# Altium schematic sheet SAMC21N_Xplained_Pro_Level_Converters.SchDoc: Data Level Converters
size A3; Organization: Microchip India; DocumentNumber: A09-2682; Revision: 4; SheetNumber: 7; SheetTotal: 9; CheckedBy: M.S.K; DrawnBy: Microchip India; PageSetup: Record=PageOptions|CenterHorizontal=True|CenterVertical=True|PrintScale=0.71|XCorrection=1.00|YCorrection=1.00|PrintKind=0|BorderSize=5000000|LeftOffset=0|BottomOffset=0|Orientation=2|PaperLength=1000|PaperWidth=1000|Scale=100|PaperSource=15|PrintQuality=600|MediaType=1|DitherType=10|PrintScaleMode=1|PaperKind=A4 (210 x 297 mm)|PaperIndex=9; ProjectTitle: ATSAMC21N-XPRO; PCBNumber: A08-2581; PCBRevision: 2
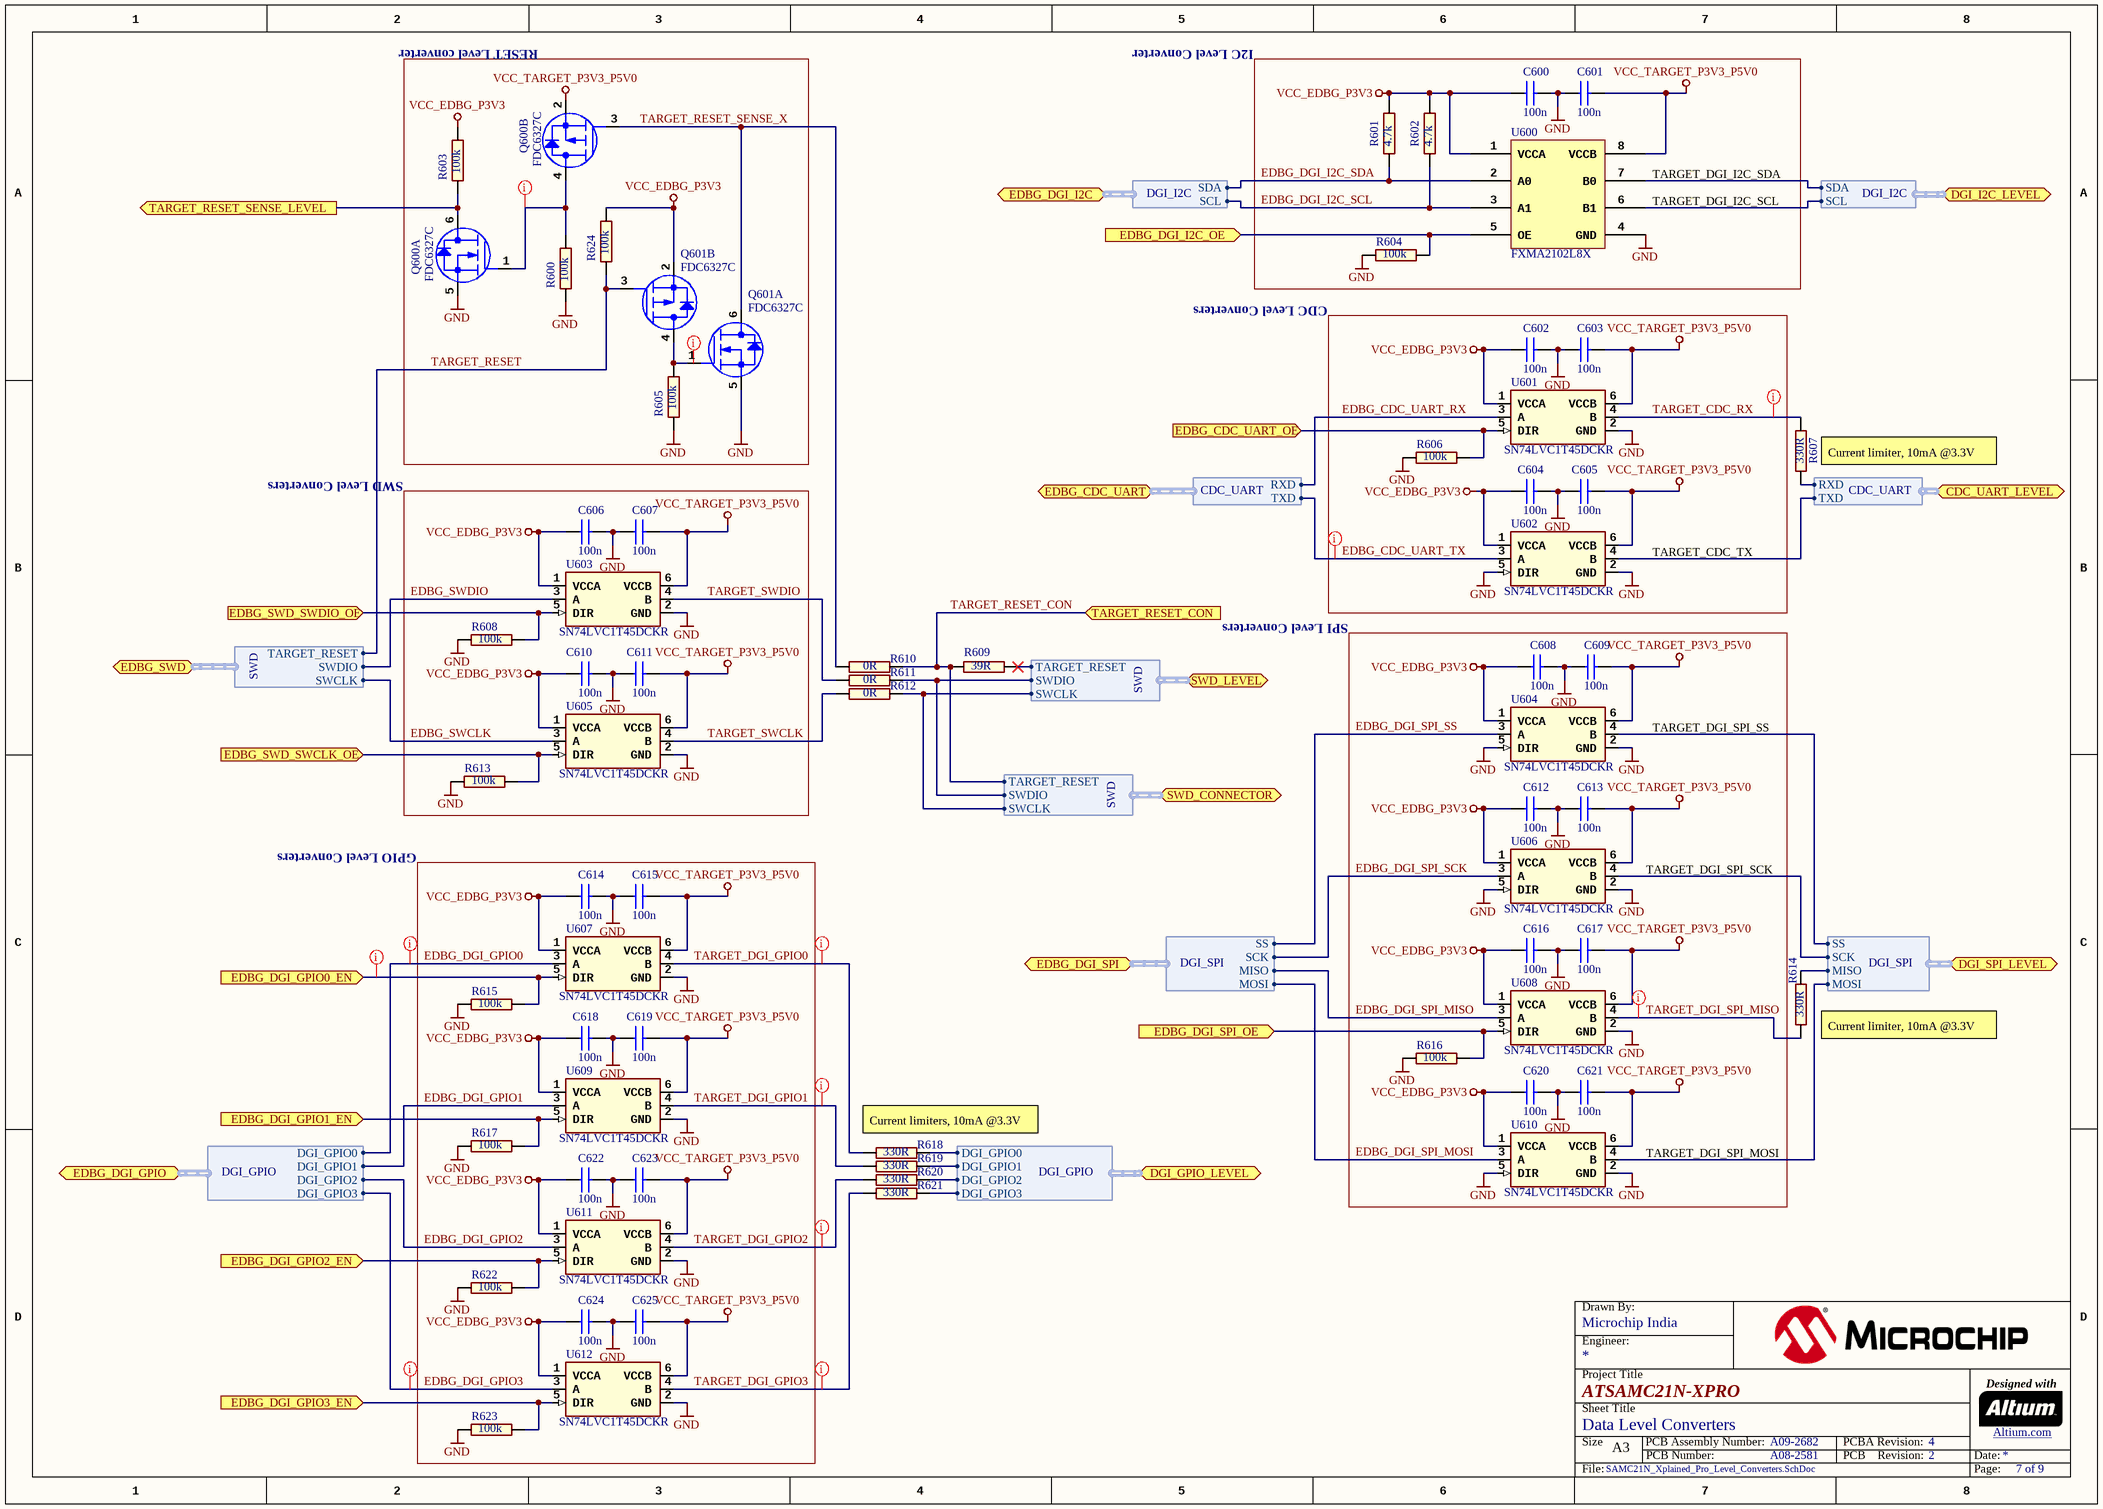
[diagram p0: SAMC21N_Xplained_Pro_Level_Converters.SchDoc]

## Parts
C600  value 100n  [AP1-00053]  (hidden comment: CAP-NONPOL)
C601  value 100n  [AP1-00053]  (hidden comment: CAP-NONPOL)
C602  value 100n  [AP1-00053]  (hidden comment: CAP-NONPOL)
C603  value 100n  [AP1-00053]  (hidden comment: CAP-NONPOL)
C604  value 100n  [AP1-00053]  (hidden comment: CAP-NONPOL)
C605  value 100n  [AP1-00053]  (hidden comment: CAP-NONPOL)
C606  value 100n  [AP1-00053]  (hidden comment: CAP-NONPOL)
C607  value 100n  [AP1-00053]  (hidden comment: CAP-NONPOL)
C608  value 100n  [AP1-00053]  (hidden comment: CAP-NONPOL)
C609  value 100n  [AP1-00053]  (hidden comment: CAP-NONPOL)
C610  value 100n  [AP1-00053]  (hidden comment: CAP-NONPOL)
C611  value 100n  [AP1-00053]  (hidden comment: CAP-NONPOL)
C612  value 100n  [AP1-00053]  (hidden comment: CAP-NONPOL)
C613  value 100n  [AP1-00053]  (hidden comment: CAP-NONPOL)
C614  value 100n  [AP1-00053]  (hidden comment: CAP-NONPOL)
C615  value 100n  [AP1-00053]  (hidden comment: CAP-NONPOL)
C616  value 100n  [AP1-00053]  (hidden comment: CAP-NONPOL)
C617  value 100n  [AP1-00053]  (hidden comment: CAP-NONPOL)
C618  value 100n  [AP1-00053]  (hidden comment: CAP-NONPOL)
C619  value 100n  [AP1-00053]  (hidden comment: CAP-NONPOL)
C620  value 100n  [AP1-00053]  (hidden comment: CAP-NONPOL)
C621  value 100n  [AP1-00053]  (hidden comment: CAP-NONPOL)
C622  value 100n  [AP1-00053]  (hidden comment: CAP-NONPOL)
C623  value 100n  [AP1-00053]  (hidden comment: CAP-NONPOL)
C624  value 100n  [AP1-00053]  (hidden comment: CAP-NONPOL)
C625  value 100n  [AP1-00053]  (hidden comment: CAP-NONPOL)
Q600  value FDC6327C  [AP5-00008]  (hidden comment: Farnell no: 9844856)  (parts A,B of 2)
Q601  value FDC6327C  [AP5-00008]  (hidden comment: Farnell no: 9844856)  (parts A,B of 2)
R600  value 100k  [AP2-00011]  (hidden comment: R2)
R601  value 4.7k  [AP2-00011]  (hidden comment: R2)
R602  value 4.7k  [AP2-00011]  (hidden comment: R2)
R603  value 100k  [AP2-00011]  (hidden comment: R2)
R604  value 100k  [AP2-00011]  (hidden comment: R2)
R605  value 100k  [AP2-00011]  (hidden comment: R2)
R606  value 100k  [AP2-00011]  (hidden comment: R2)
R607  value 330R  [AP2-00011]  (hidden comment: R2)
R608  value 100k  [AP2-00011]  (hidden comment: R2)
R609  value 39R  [AP2-00011]  (hidden comment: R2)
R610  value 0R  [AP2-00000]  (hidden comment: R2)
R611  value 0R  [AP2-00000]  (hidden comment: R2)
R612  value 0R  [AP2-00000]  (hidden comment: R2)
R613  value 100k  [AP2-00011]  (hidden comment: R2)
R614  value 330R  [AP2-00011]  (hidden comment: R2)
R615  value 100k  [AP2-00011]  (hidden comment: R2)
R616  value 100k  [AP2-00011]  (hidden comment: R2)
R617  value 100k  [AP2-00011]  (hidden comment: R2)
R618  value 330R  [AP2-00011]  (hidden comment: R2)
R619  value 330R  [AP2-00011]  (hidden comment: R2)
R620  value 330R  [AP2-00011]  (hidden comment: R2)
R621  value 330R  [AP2-00011]  (hidden comment: R2)
R622  value 100k  [AP2-00011]  (hidden comment: R2)
R623  value 100k  [AP2-00011]  (hidden comment: R2)
R624  value 100k  [AP2-00011]  (hidden comment: R2)
U600  value FXMA2102L8X  [AP6-00258]  (hidden comment: FXMA2102)
U601  SN74LVC1T45DCKR  [AP6-00015]
U602  SN74LVC1T45DCKR  [AP6-00015]
U603  SN74LVC1T45DCKR  [AP6-00015]
U604  SN74LVC1T45DCKR  [AP6-00015]
U605  SN74LVC1T45DCKR  [AP6-00015]
U606  SN74LVC1T45DCKR  [AP6-00015]
U607  SN74LVC1T45DCKR  [AP6-00015]
U608  SN74LVC1T45DCKR  [AP6-00015]
U609  SN74LVC1T45DCKR  [AP6-00015]
U610  SN74LVC1T45DCKR  [AP6-00015]
U611  SN74LVC1T45DCKR  [AP6-00015]
U612  SN74LVC1T45DCKR  [AP6-00015]

## Blocks framed on the sheet
RESET Level converter: Q600 Q601 R600 R603 R605 R624
I2C Level Converter: C600 C601 R601 R602 R604 U600
CDC Level Converters: C602-C605 R606 U601 U602
SWD Level Converters: C606 C607 C610 C611 R608 R613 U603 U605
SPI Level Converters: C608 C609 C612 C613 C616 C617 C620 C621 R616 U604 U606 U608 U610
GPIO Level Converters: C614 C615 C618 C619 C622-C625 R615 R617 R622 R623 U607 U609 U611 U612

## Ports
CDC_UART_LEVEL (harness CDC_UART), DGI_GPIO_LEVEL (harness DGI_GPIO), DGI_I2C_LEVEL (harness DGI_I2C), DGI_SPI_LEVEL (harness DGI_SPI), EDBG_CDC_UART (harness CDC_UART), EDBG_CDC_UART_OE (in), EDBG_DGI_GPIO0_EN (in), EDBG_DGI_GPIO1_EN (in), EDBG_DGI_GPIO2_EN (in), EDBG_DGI_GPIO3_EN (in), EDBG_DGI_GPIO (harness DGI_GPIO), EDBG_DGI_I2C (harness DGI_I2C), EDBG_DGI_I2C_OE (in), EDBG_DGI_SPI (harness DGI_SPI), EDBG_DGI_SPI_OE (in), EDBG_SWD (harness SWD), EDBG_SWD_SWCLK_OE (in), EDBG_SWD_SWDIO_OE (in), SWD_CONNECTOR (harness SWD), SWD_LEVEL (harness SWD), TARGET_RESET_CON (in), TARGET_RESET_SENSE_LEVEL (out)

## Harnesses
DGI_GPIO: DGI_GPIO0, DGI_GPIO1, DGI_GPIO2, DGI_GPIO3
DGI_SPI: MISO, MOSI, SCK, SS
DGI_I2C: SCL, SDA
CDC_UART: RXD, TXD
SWD: SWCLK, SWDIO, TARGET_RESET

## Nets
GND: C600.2 C601.1 C602.2 C603.1 C604.2 C605.1 C606.2 C607.1 C608.2 C609.1 C610.2 C611.1 C612.2 C613.1 C614.2 C615.1 C616.2 C617.1 C618.2 C619.1 C620.2 C621.1 C622.2 C623.1 C624.2 C625.1 Q600.5(S) Q601.5(S) R600.1 R604.1 R605.1 R606.2 R608.2 R613.2 R615.2 R616.2 R617.2 R622.2 R623.2 U600.4(GND) U601.2(GND) U602.2(GND) U602.5(DIR) U603.2(GND) U604.2(GND) U604.5(DIR) U605.2(GND) U606.2(GND) U606.5(DIR) U607.2(GND) U608.2(GND) U609.2(GND) U610.2(GND) U610.5(DIR) U611.2(GND) U612.2(GND)
VCC_EDBG_P3V3: C600.1 C602.1 C604.1 C606.1 C608.1 C610.1 C612.1 C614.1 C616.1 C618.1 C620.1 C622.1 C624.1 Q601.2(S) R601.2 R602.2 R603.2 R624.2 U600.1(VCCA) U601.1(VCCA) U602.1(VCCA) U603.1(VCCA) U604.1(VCCA) U605.1(VCCA) U606.1(VCCA) U607.1(VCCA) U608.1(VCCA) U609.1(VCCA) U610.1(VCCA) U611.1(VCCA) U612.1(VCCA)
VCC_TARGET_P3V3_P5V0: C601.2 C603.2 C605.2 C607.2 C609.2 C611.2 C613.2 C615.2 C617.2 C619.2 C621.2 C623.2 C625.2 Q600.2(S) U600.8(VCCB) U601.6(VCCB) U602.6(VCCB) U603.6(VCCB) U604.6(VCCB) U605.6(VCCB) U606.6(VCCB) U607.6(VCCB) U608.6(VCCB) U609.6(VCCB) U610.6(VCCB) U611.6(VCCB) U612.6(VCCB)
EDBG_CDC_UART_OE: R606.1 U601.5(DIR) ; port EDBG_CDC_UART_OE
EDBG_CDC_UART_RX: U601.3(A) ; port EDBG_CDC_UART.RXD
EDBG_CDC_UART_TX: U602.3(A) ; port EDBG_CDC_UART.TXD
EDBG_DGI_GPIO0: U607.3(A) ; port EDBG_DGI_GPIO.DGI_GPIO0
EDBG_DGI_GPIO0_EN: R615.1 U607.5(DIR) ; port EDBG_DGI_GPIO0_EN
EDBG_DGI_GPIO1: U609.3(A) ; port EDBG_DGI_GPIO.DGI_GPIO1
EDBG_DGI_GPIO1_EN: R617.1 U609.5(DIR) ; port EDBG_DGI_GPIO1_EN
EDBG_DGI_GPIO2: U611.3(A) ; port EDBG_DGI_GPIO.DGI_GPIO2
EDBG_DGI_GPIO2_EN: R622.1 U611.5(DIR) ; port EDBG_DGI_GPIO2_EN
EDBG_DGI_GPIO3: U612.3(A) ; port EDBG_DGI_GPIO.DGI_GPIO3
EDBG_DGI_GPIO3_EN: R623.1 U612.5(DIR) ; port EDBG_DGI_GPIO3_EN
EDBG_DGI_I2C_OE: R604.2 U600.5(OE) ; port EDBG_DGI_I2C_OE
EDBG_DGI_I2C_SCL: R602.1 U600.3(A1) ; port EDBG_DGI_I2C.SCL
EDBG_DGI_I2C_SDA: R601.1 U600.2(A0) ; port EDBG_DGI_I2C.SDA
EDBG_DGI_SPI_MISO: U608.3(A) ; port EDBG_DGI_SPI.MISO
EDBG_DGI_SPI_MOSI: U610.3(A) ; port EDBG_DGI_SPI.MOSI
EDBG_DGI_SPI_OE: R616.1 U608.5(DIR) ; port EDBG_DGI_SPI_OE
EDBG_DGI_SPI_SCK: U606.3(A) ; port EDBG_DGI_SPI.SCK
EDBG_DGI_SPI_SS: U604.3(A) ; port EDBG_DGI_SPI.SS
EDBG_SWCLK: U605.3(A) ; port EDBG_SWD.SWCLK
EDBG_SWD_SWCLK_OE: R613.1 U605.5(DIR) ; port EDBG_SWD_SWCLK_OE
EDBG_SWD_SWDIO_OE: R608.1 U603.5(DIR) ; port EDBG_SWD_SWDIO_OE
EDBG_SWDIO: U603.3(A) ; port EDBG_SWD.SWDIO
TARGET_CDC_RX: R607.2 U601.4(B)
TARGET_DGI_GPIO0: R618.1 U607.4(B)
TARGET_DGI_GPIO1: R619.1 U609.4(B)
TARGET_DGI_GPIO2: R620.1 U611.4(B)
TARGET_DGI_GPIO3: R621.1 U612.4(B)
TARGET_DGI_SPI_MISO: R614.1 U608.4(B)
TARGET_RESET: Q601.3(G) R624.1 ; port EDBG_SWD.TARGET_RESET
TARGET_RESET_CON: R609.1 R610.2 ; port TARGET_RESET_CON, port SWD_CONNECTOR.TARGET_RESET
TARGET_RESET_SENSE_LEVEL: Q600.6(D) R603.1 ; port TARGET_RESET_SENSE_LEVEL
TARGET_RESET_SENSE_X: Q600.3(G) Q601.6(D) R610.1
TARGET_SWCLK: R612.1 U605.4(B)
TARGET_SWDIO: R611.1 U603.4(B)
NetQ600_1: Q600.1(G) Q600.4(D) R600.2
NetQ601_1: Q601.1(G) Q601.4(D) R605.2
NetR607_1: R607.1 ; port CDC_UART_LEVEL.RXD
NetR609_2: R609.2 ; port SWD_LEVEL.TARGET_RESET
NetR611_2: R611.2 ; port SWD_LEVEL.SWDIO, port SWD_CONNECTOR.SWDIO
NetR612_2: R612.2 ; port SWD_LEVEL.SWCLK, port SWD_CONNECTOR.SWCLK
NetR614_2: R614.2 ; port DGI_SPI_LEVEL.MISO
NetR618_2: R618.2 ; port DGI_GPIO_LEVEL.DGI_GPIO0
NetR619_2: R619.2 ; port DGI_GPIO_LEVEL.DGI_GPIO1
NetR620_2: R620.2 ; port DGI_GPIO_LEVEL.DGI_GPIO2
NetR621_2: R621.2 ; port DGI_GPIO_LEVEL.DGI_GPIO3
NetU600_6: U600.6(B1) ; port DGI_I2C_LEVEL.SCL
NetU600_7: U600.7(B0) ; port DGI_I2C_LEVEL.SDA
NetU602_4: U602.4(B) ; port CDC_UART_LEVEL.TXD
NetU604_4: U604.4(B) ; port DGI_SPI_LEVEL.SS
NetU606_4: U606.4(B) ; port DGI_SPI_LEVEL.SCK
NetU610_4: U610.4(B) ; port DGI_SPI_LEVEL.MOSI

## Layout directives
rule Assembly Testpoint Usage [Testpoint - Not Allowed    Multiple - Not Allowed]: (no net found under the mark), EDBG_CDC_UART_TX, EDBG_DGI_GPIO0, EDBG_DGI_GPIO0_EN, EDBG_DGI_GPIO3, NetQ600_1, TARGET_CDC_RX, TARGET_DGI_GPIO0, TARGET_DGI_GPIO1, TARGET_DGI_GPIO2, TARGET_DGI_GPIO3, TARGET_DGI_SPI_MISO

## Notes on the sheet
- (near U600) TARGET_DGI_I2C_SDA
- (near U600) TARGET_DGI_I2C_SCL
- (near R607) Current limiter, 10mA @3.3V
- (near U602) TARGET_CDC_TX
- (near U604) TARGET_DGI_SPI_SS
- (near U606) TARGET_DGI_SPI_SCK
- (near R614) Current limiter, 10mA @3.3V
- Current limiters, 10mA @3.3V
- (near U610) TARGET_DGI_SPI_MOSI
- Drawn By:
- Project Title
- Engineer:
- Designed with
- Sheet Title
- Size
- A3
- PCB Number:
- PCB Assembly Number:
- PCBA Revision:
- PCB    Revision:
- Date:
- Altium.com <http://go.altium.com/MicrochipLandingPage_Evaluation.html>
- File:
- Page:

## Library data of the parts
C600-C625 = A01-0246: Ceramic capacitor, SMD 0402, X7R, 16V, +/-10%; PartGroup: Capacitors,Ceramic,SMD 0402; Manufacturer: Kemet; MPN: C0402C104K4RACTU; TemperatureRange: -55 - +125 deg C; ComponentStatus: 'Active (verified)'; Status: Active; Verified by: Lars Helge Mo; Verified date: 2005-12-15; AN: A01-0246; Tolerance: 16V, +/-10%; Height: 0,5; FootprintStatus: 'Active (Verified)'
Q600 Q601 = A05-0040: Dual N/P-ch MOSFET, 20V, 2.7A/-1.9A cont, 8A/-8A pulse, RDS(ON)<0.08/0.17Ohm@VGS=4.5V, VGS(th)<1.5/-1.5V, SSOT6; PartGroup: Transistors,Power FET,SMD; Manufacturer: Fairchild; TemperatureRange: -55 - +150 deg C; ComponentStatus: 'Active (verified)'; Status: New; AN: A05-0040; Height: 1.10000002384186; MPN: FDC6327C; FootprintStatus: 'Active (Verified)'
R600 R603-R606 R608 R613 R615-R617 R622-R624 = A02-0260: Thick film resistor, SMD 0402, 1/16W, 1%; PartGroup: Resistors,SMD,0402 1%; TemperatureRange: -55 - +125 deg C; ComponentStatus: 'Active (verified)'; Status: Active; Verified by: Lars Helge Mo; Verified date: 2005-12-19; AN: A02-0260; Tolerance: 1 %; Height: 0,349999994039536; FootprintStatus: 'Active (Verified)'
R601 R602 = A02-0228: Thick film resistor, SMD 0402, 1/16W, 1%; PartGroup: Resistors,SMD,0402 1%; TemperatureRange: -55ï¿½ to +125ï¿½C; ComponentStatus: 'Active (verified)'; Status: Active; Verified by: Lars Helge Mo; Verified date: 2005-12-19; AN: A02-0228; Tolerance: 1 %; Height: 0.349999994039536; FootprintStatus: 'Active (Verified)'
R607 R614 R618-R621 = A02-0200: Thick film resistor, SMD 0402, 1/16W, 1%; PartGroup: Resistors,SMD,0402 1%; TemperatureRange: -55 - +125 deg C; ComponentStatus: 'Active (verified)'; Status: Active; Verified by: Lars Helge Mo; Verified date: 2005-12-19; AN: A02-0200; Tolerance: 1 %; Height: 0,349999994039536; FootprintStatus: 'Active (Verified)'
R609 = A02-0178: Thick film resistor, SMD 0402, 1/16W, 1%; PartGroup: Resistors,SMD,0402 1%; TemperatureRange: -55 - +125 deg C; ComponentStatus: 'Active (verified)'; Status: Active; Verified by: Lars Helge Mo; Verified date: 2005-12-19; AN: A02-0178; Tolerance: 1 %; Height: 0,349999994039536; FootprintStatus: 'Active (Verified)'
R610-R612 = A02-0163: Thick film resistor, SMD 0402, 1/16W, 1%; PartGroup: Resistors,SMD,0402 1%; TemperatureRange: -55 - +125 deg C; ComponentStatus: 'Active (verified)'; Status: Active; Verified by: Lars Helge Mo; Verified date: 2005-12-19; AN: A02-0163; Tolerance: 1 %; Height: 0.349999994039536; FootprintStatus: 'Active (Verified)'
U600 = A06-0714: Dual supply, 2-bit, voltage translator, buffer, repeater, isolator for I2C applications; PartGroup: Integrated Circuits,Interface ICs,I2C; Manufacturer: Fairchild; TemperatureRange: -40 - +85 deg C; ComponentStatus: 'Active (verified)'; AN: A06-0714; Height: 0.550000011920929; MPN: FXMA2102L8X; FootprintStatus: 'Active (Verified)'
U601-U612 = A06-1038: Single-Bit Dual-Supply Bus Transceiver with Configurable Voltage Translation and 3-State Outputs; PartGroup: Integrated Circuits,Interface ICs,Level translators; Manufacturer: Texas Instruments; TemperatureRange: –40 - 85 °C; ComponentStatus: 'Active (verified)'; Status: Verified; Verified date: 29.08.2013; Verified by: Sveinung Helgeland; AN: A06-1038; Value: SN74LVC1T45DCKR; Height: 1.10000002384186; MPN: SN74LVC1T45DCKR; FootprintStatus: 'Active (Verified)'